# Altium schematic sheet 07)Power,JTAG,RESET.SchDoc
size 297 x 209 mm
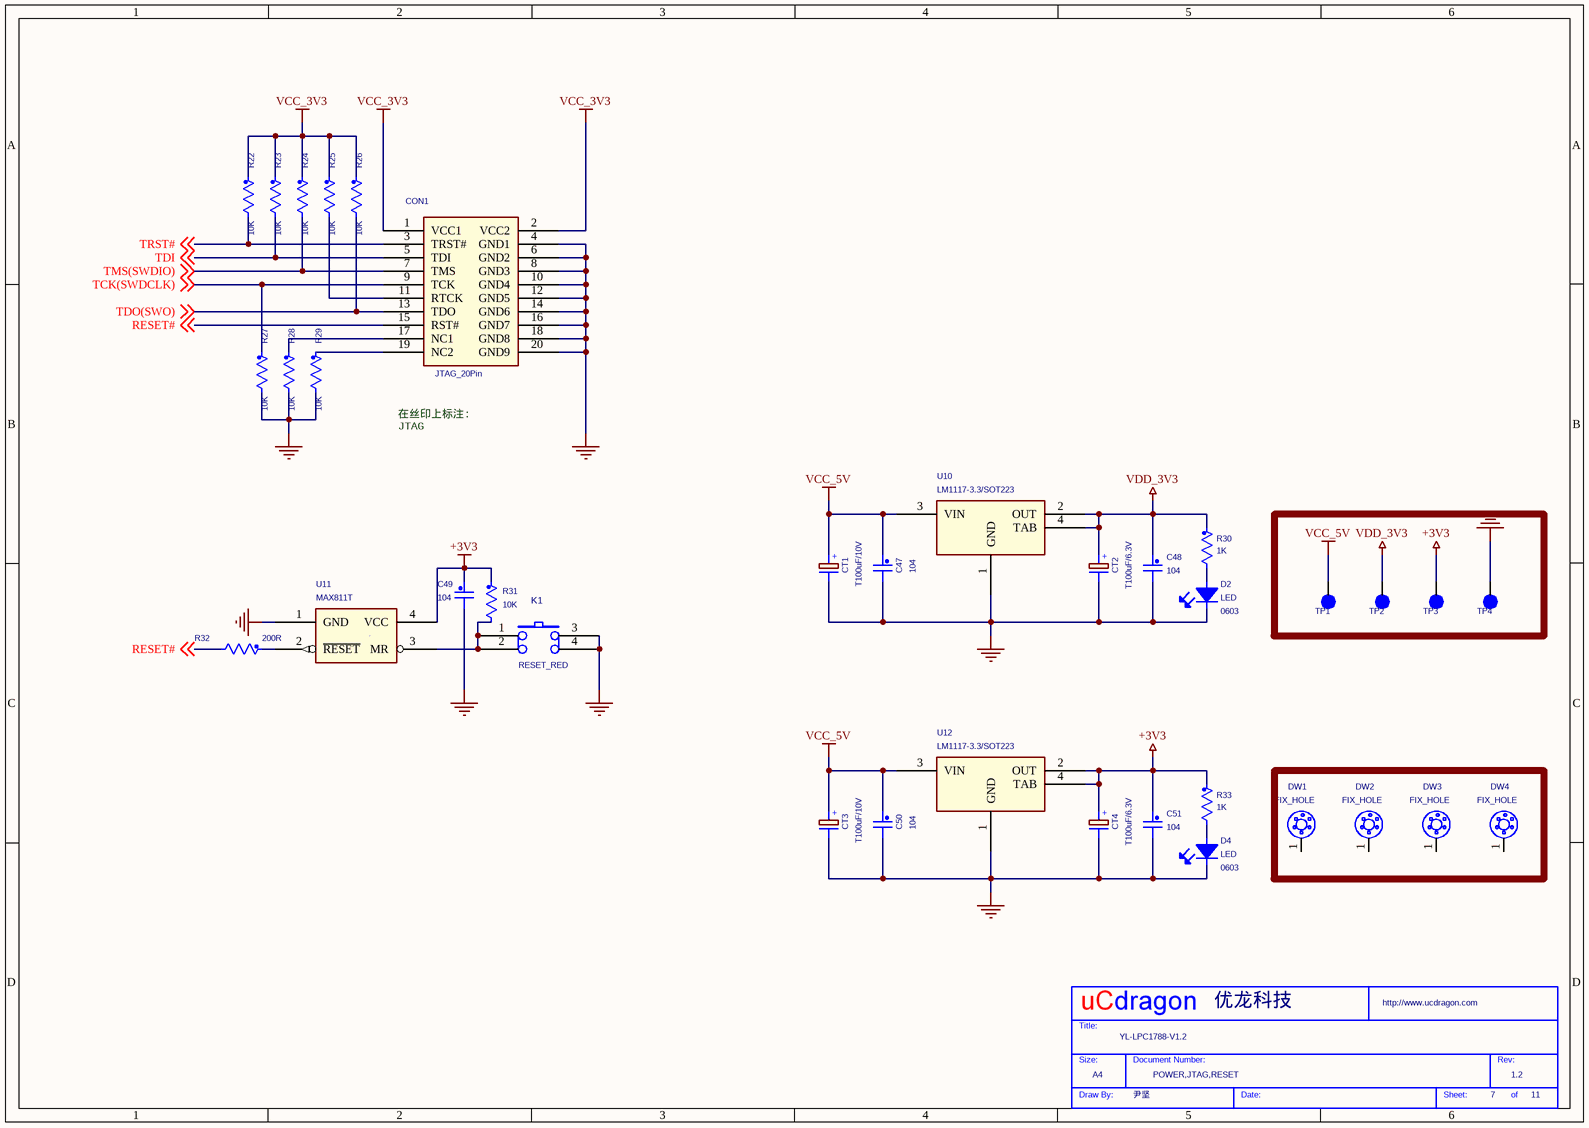
[diagram p0: 07)Power,JTAG,RESET.SchDoc]

## Parts
*  Page Count: 11  Page Number: 7  Page Size: A4  Title: YL-LPC1788-V1.2  RevCode: 1.2  Doc: POWER,JTAG,RESET  Drawing: 尹坚  Company: 优龙科技  (hidden comment: My Title 0)  (graphical)
C47  104  [CAP0805]
C48  104  [CAP0805]
C49  104  [CAP0805]
C50  104  [CAP0805]
C51  104  [CAP0805]
CON1  JTAG_20Pin
CT1  T100uF/10V  [TAN-C]
CT2  T100uF/6.3V  [TAN-B]
CT3  T100uF/10V  [TAN-C]
CT4  T100uF/6.3V  [TAN-B]
D2  LED  Note: 0603  [LED3]
D4  LED  Note: 0603  [LED3]
DW1  FIX_HOLE  [FULCRUM2]
DW2  FIX_HOLE  [FULCRUM2]
DW3  FIX_HOLE  [FULCRUM2]
DW4  FIX_HOLE  [FULCRUM2]
K1  RESET_RED  [SWPB2]
R22  10K  [RES0805]
R23  10K  [RES0805]
R24  10K  [RES0805]
R25  10K  [RES0805]
R26  10K  [RES0805]
R27  10K  [RES0805]
R28  10K  [RES0805]
R29  10K  [RES0805]
R30  1K  [RES0805]
R31  10K  [RES0805]
R32  200R  [RES0805]
R33  1K  [RES0805]
TP1  TP-SMD  (value not drawn)
TP2  TP-SMD  (value not drawn)
TP3  TP-SMD  (value not drawn)
TP4  TP-SMD  (value not drawn)
U10  LM1117-3.3/SOT223  [XP-SOT223-3]
U11  MAX811T  [SOT143A]
U12  LM1117-3.3/SOT223  [XP-SOT223-3]

## Nets
+3V3: C49.1 C51.1 CT4.1 R31.1 R33.1 TP3.1 U11.4(VCC) U12.2(OUT) U12.4(TAB)
GND_POWER: C47.2 C48.2 C49.2 C50.2 C51.2 CON1.4(GND1) CON1.6(GND2) CON1.8(GND3) CON1.10(GND4) CON1.12(GND5) CON1.14(GND6) CON1.16(GND7) CON1.18(GND8) CON1.20(GND9) CT1.2 CT2.2 CT3.2 CT4.2 D2.2(K) D4.2(K) K1.3 K1.4 R27.2 R28.2 R29.2 TP4.1 U10.1(GND) U11.1(GND) U12.1(GND)
VCC_3V3: CON1.1(VCC1) CON1.2(VCC2) R22.1 R23.1 R24.1 R25.1 R26.1
VCC_5V: C47.1 C50.1 CT1.1 CT3.1 TP1.1 U10.3(VIN) U12.3(VIN)
VDD_3V3: C48.1 CT2.1 R30.1 TP2.1 U10.2(OUT) U10.4(TAB)
RESET#: CON1.15(RST#) R32.2 ; off-sheet RESET#
TCK(SWDCLK): CON1.9(TCK) R27.1 ; off-sheet TCK(SWDCLK)
TDI: CON1.5(TDI) R23.2 ; off-sheet TDI
TDO(SWO): CON1.13(TDO) R26.2 ; off-sheet TDO(SWO)
TMS(SWDIO): CON1.7(TMS) R24.2 ; off-sheet TMS(SWDIO)
TRST#: CON1.3(TRST#) R22.2 ; off-sheet TRST#
NetCON1_11: CON1.11(RTCK) R25.2
NetCON1_17: CON1.17(NC1) R28.1
NetCON1_19: CON1.19(NC2) R29.1
NetD2_1: D2.1(A) R30.2
NetD4_1: D4.1(A) R33.2
NetK1_1: K1.1 K1.2 R31.2 U11.3(MR)
NetR32_1: R32.1 U11.2(~{RESET})

Not connected (* = marked no-connect by the designer): DW1 1; DW2 1; DW3 1; DW4 1

## Notes on the sheet
- 在丝印上标注:
  JTAG
- (in symbol CAP PN_Dup1) +
- (in symbol My Title 0) Title:; Size:; Document Number:; Rev:; Draw By:; Date:; Sheet:; of

## Library data of the parts
C47-C51 = C_Generic_Dup1: Dielectric: X7R; Mfg #1: KEMET; Voltage: 16V; P/N #1: C0603C104K4RAC; Toler.: 10%
CT1-CT4 = CAP PN_Dup1: SDTSourceLibName: C:\WINDOWS\TEMP\SNDS.LIB
D2 D4 = LED-Small
K1 = SW_PUSH2: SDTSourceLibName: C:\WIND95\TEMP\6200.LIB
R22-R29 R31 R32 = R_Generic_Dup1: Toler.: 1%; Watts: 0.1W; P/N #1: CR10-1001F-T; Mfg #1: AVX
R30 R33 = R_Generic_Dup1: P/N #3: CR10-103J-T; Toler.: 1%; Watts: 0.1W; P/N #1: RK73H1JT1002F; Mfg #1: KOA SPEER; Mfg #3: AVX
TP1-TP4 = TP-SMD_1
U10 U12 = LM1117 SOT223
U11 = UD215_1
* = My Title 0: Page Create Date: May 29, 2006; WebSite: http://www.ucdragon.com